# Altium schematic sheet micro.SchDoc
size A4; SheetNumber: 1; SheetTotal: 1
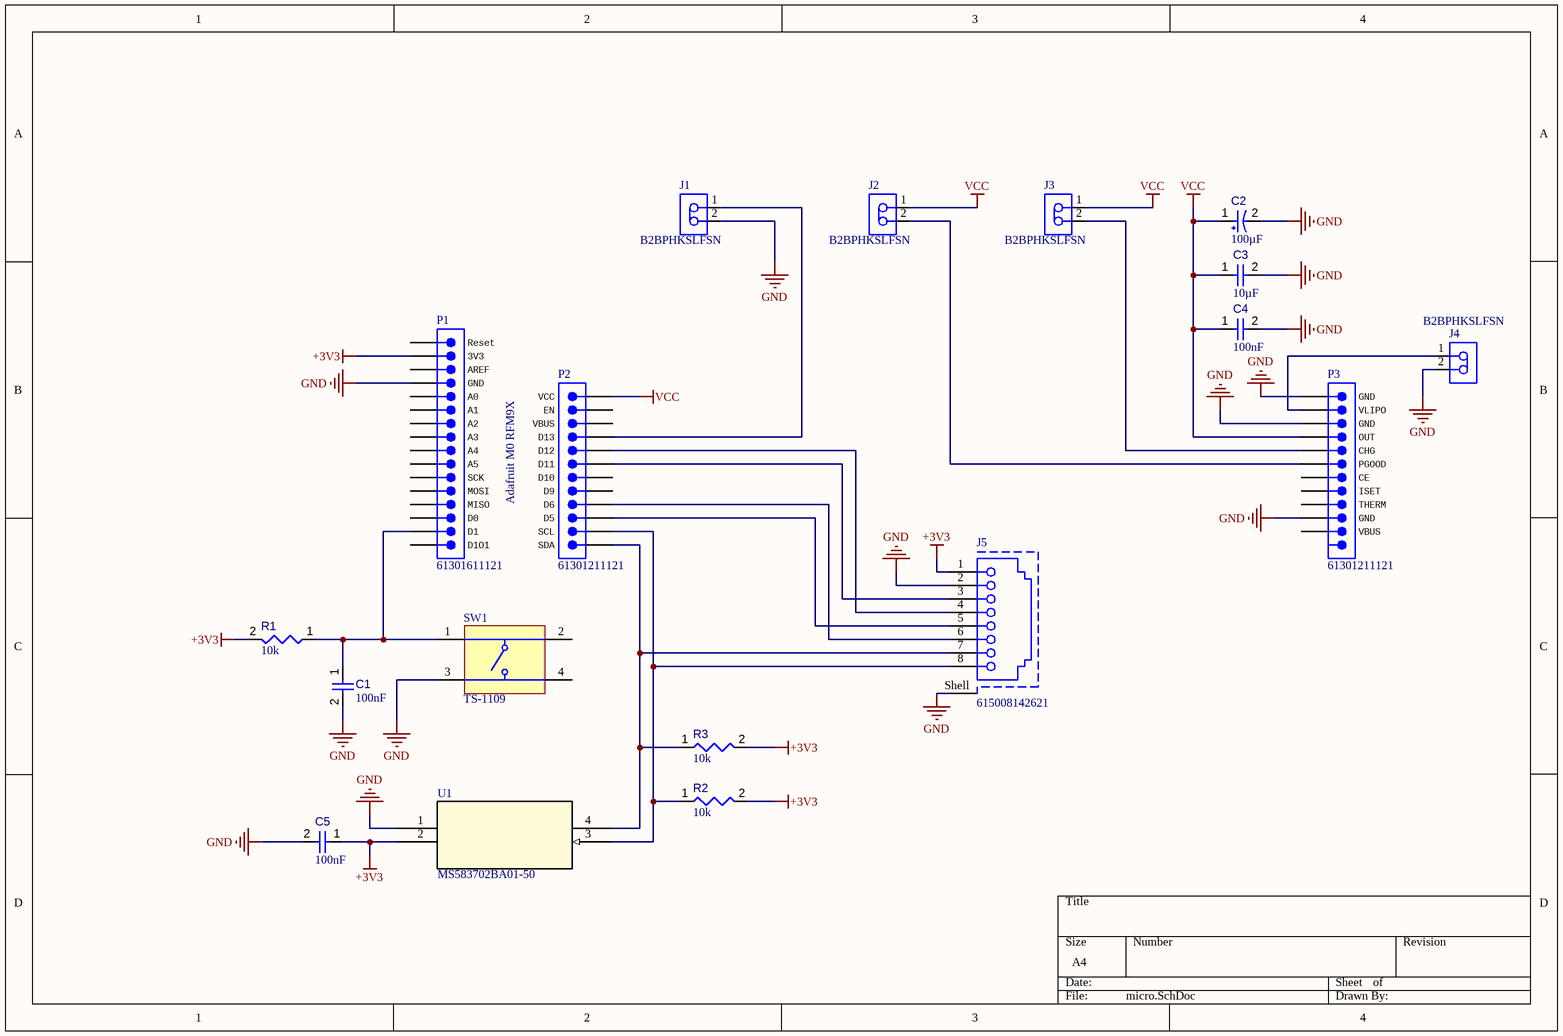
[diagram p0: micro.SchDoc]

## Parts
C1  value 100nF  [CAPC2013X95X50LL10T25]  (hidden comment: Capacitor 100 nF +/-10% 50 V 0805)
C2  value 100µF  [CAPPR65-350-1150X800X1250]  (hidden comment: ECA1HM101)
C3  value 10µF  [CAPC0805(2012)145_L]  (hidden comment: Capacitor 10µF +/-20% 25V 0805)
C4  value 100nF  [CAPC2013X95X50LL10T25]  (hidden comment: Capacitor 100 nF +/-10% 50 V 0805)
C5  value 100nF  [CAPC2013X95X50LL10T25]  (hidden comment: Capacitor 100 nF +/-10% 50 V 0805)
J1  B2BPHKSLFSN  [JST-B2B-PH-K-S_V]
J2  B2BPHKSLFSN  [JST-B2B-PH-K-S_V]
J3  B2BPHKSLFSN  [JST-B2B-PH-K-S_V]
J4  B2BPHKSLFSN  [JST-B2B-PH-K-S_V]
J5  615008142621  [615008142621]
P1  61301611121  [61301611121]
P2  61301211121  [61301211121]
P3  61301211121  [61301211121]
R1  value 10k  [RESC2013X50X35ML15T15]  (hidden comment: Resistor 10k +/-1% 0805 125 mW)
R2  value 10k  [RESC2013X50X35ML15T15]  (hidden comment: Resistor 10k +/-1% 0805 125 mW)
R3  value 10k  [RESC2013X50X35ML15T15]  (hidden comment: Resistor 10k +/-1% 0805 125 mW)
SW1  TS-1109  [BEST-TS-1109_V]
U1  MS583702BA01-50  [MS5837-02BA01_TEC]

## Nets
+3V3: C5.1 J5.1 P1.2(3V3) R1.2 R2.2 R3.2 U1.2(VDD)
GND: C1.2 C2.2 C3.2 C4.2 C5.2 J1.2 J4.2 J5.2 J5.Shell P1.4(GND) P3.1(GND) P3.3(GND) P3.10(GND) SW1.3 U1.1(GND)
VCC: C2.1 C3.1 C4.1 J2.1 J3.1 P2.1(VCC) P3.4(OUT)
NetC1_1: C1.1 P1.15(D1) R1.1 SW1.1
NetJ1_1: J1.1 P2.4(D13)
NetJ2_2: J2.2 P3.6(PGOOD)
NetJ3_2: J3.2 P3.5(CHG)
NetJ4_1: J4.1 P3.2(VLIPO)
NetJ5_3: J5.3 P2.6(D11)
NetJ5_4: J5.4 P2.5(D12)
NetJ5_5: J5.5 P2.10(D5)
NetJ5_6: J5.6 P2.9(D6)
NetJ5_7: J5.7 P2.12(SDA) R3.1 U1.4(SDA)
NetJ5_8: J5.8 P2.11(SCL) R2.1 U1.3(SCL)

Not connected (* = marked no-connect by the designer): P1 1(Reset) 3(AREF) 5(A0) 6(A1) 7(A2) 8(A3) 9(A4) 10(A5) 11(SCK) 12(MOSI) 13(MISO) 14(D0) 16(D1O1); P2 2(EN) 3(VBUS) 7(D10) 8(D9); P3 7(CE) 8(ISET) 9(THERM) 11(VBUS); SW1 2 4

## Notes on the sheet
- Adafruit M0 RFM9X

## Library data of the parts
C1 C4 C5 = CMP-001-00018-6: Chip Capacitor, 100 nF, +/- 10%, 50 V, 0805 (2012 Metric); Capacitor Type: Ceramic; Voltage Rating: 50V; Pins: 2; Max Operating Temperature: 125°C; Min Operating Temperature: -55°C; Mounting Technology: SM; Case/Package: 0805; RoHS Compliant: True; Tolerance: 10%
C2 = CMP-001-00026-7: Aluminum Electrolytic Capacitor, 100 uF, +/- 20%, 50 V, -40 to 85 degC, 2-Pin THD, RoHS, Bulk; Manufacturer: Panasonic; Voltage Rating: 50V; Ripple Current: 250mA; Datasheet URL: https://industrial.panasonic.com/cdbs/www-data/pdf/RDF0000/ABA0000C1218.pdf; Lead Pitch: 3.5mm; Mounting Technology: TH; Package Description: 2-Pin Radial Lead, Dia 8 mm, Height 12.5 mm; Diameter: 8mm; Ripple Current (AC): 250mA; Manufacturer URL: http://www.panasonic.com/; Capacitor Type: Electrolytic; Max Operating Temperature: 85°C; Pins: 2; Min Operating Temperature: -40°C; Tolerance: 20%; Case/Package: Radial; Packaging: Bulk; Package Quantity: 200; Package Reference: CAPPR65-350-1150X800X1250; RoHS Compliant: True; Datasheet Version: Rev. 05, 10/2016
C3 = CMP-001-00079-4: Chip Capacitor, 10µF +/-20%, 25V, 0805, Thickness 1.45 mm; Tolerance: 10%; Max Operating Temperature: 85°C; Case/Package: 0805; Voltage Rating: 25V; Min Operating Temperature: -55°C; Mounting Technology: SMT; Pins: 2
J1-J4 = CMP-002-00081-1: Connector Header, PH Series, 2 Position, 2.00mm, Through Hole, Press-Fit, Solder, Natural
J5 = CMP-002-00088-1: Telecom and Datacom Connector, 8 Contact(s), Female, Right Angle, Solder Terminal, Locking, Jack; RoHS Compliant: Yes; Mounting Technology: Board; Min Operating Temperature: -40°C; Max Operating Temperature: 85°C; Connector Type: TELECOM AND DATACOM CONNECTOR
P1 = CMP-002-00079-1: Board Connector, 16 Contact(s), 1 Row(s), Male, Straight, 0.1 inch Pitch, Solder Terminal, Locking, Black Insulator, Plug; RoHS Compliant: Yes; Min Operating Temperature: -40°C; Connector Type: BOARD CONNECTOR; Max Operating Temperature: 125°C; Mounting Technology: Board
P2 P3 = CMP-002-00080-1: Board Connector, 12 Contact(s), 1 Row(s), Male, Straight, 0.1 inch Pitch, Solder Terminal, Locking, Black Insulator, Plug; RoHS Compliant: Yes; Max Operating Temperature: 125°C; Connector Type: BOARD CONNECTOR; Mounting Technology: Board; Min Operating Temperature: -40°C
R1-R3 = CMP-009-00018-5: Chip Resistor, 10 KOhm, +/- 1%, 125 mW, -55 to 155 degC, 0805 (2012 Metric); Power: 125mW; Voltage Rating: 150V; Tolerance: 1%; Pins: 2; Min Operating Temperature: -55°C; Case/Package: 0805; Max Operating Temperature: 155°C; RoHS Compliant: True; Mounting Technology: SM
SW1 = CMP-011-00002-2: Tactile Switch, SPST, 12 V, 50 mA, -20 to 80 degC, 4-Pin THD; Manufacturer: Shenzhen Best; RoHS Compliant: Unknown; Manufacturer URL: www.best-dz.com/; Case/Package: TS-1109; Package Reference: TS-1109; Datasheet Version: Dec-12; Mounting Technology: TH; Package Description: 4-Pin Through Hole Device, Body 6.2 x 6.2 mm; Datasheet URL: http://datasheet.octopart.com/TS-1109-Best-Inc.-datasheet-30458100.pdf
U1 = CMP-006-000001-1: No Description Available; Mfr_Name: TE Connectivity; RefDes: RefDes; Type: DEV; Source: MS583702BA01-50.SchLib; Manufacturer_Part_Number: MS583702BA01-50; Design Item ID: MS583702BA01-50; Copyright: Copyright (C) 2023 Ultra Librarian. All rights reserved.